# EAGLE design ADSR Waveform v1.1 (EAGLE 7.6.0)
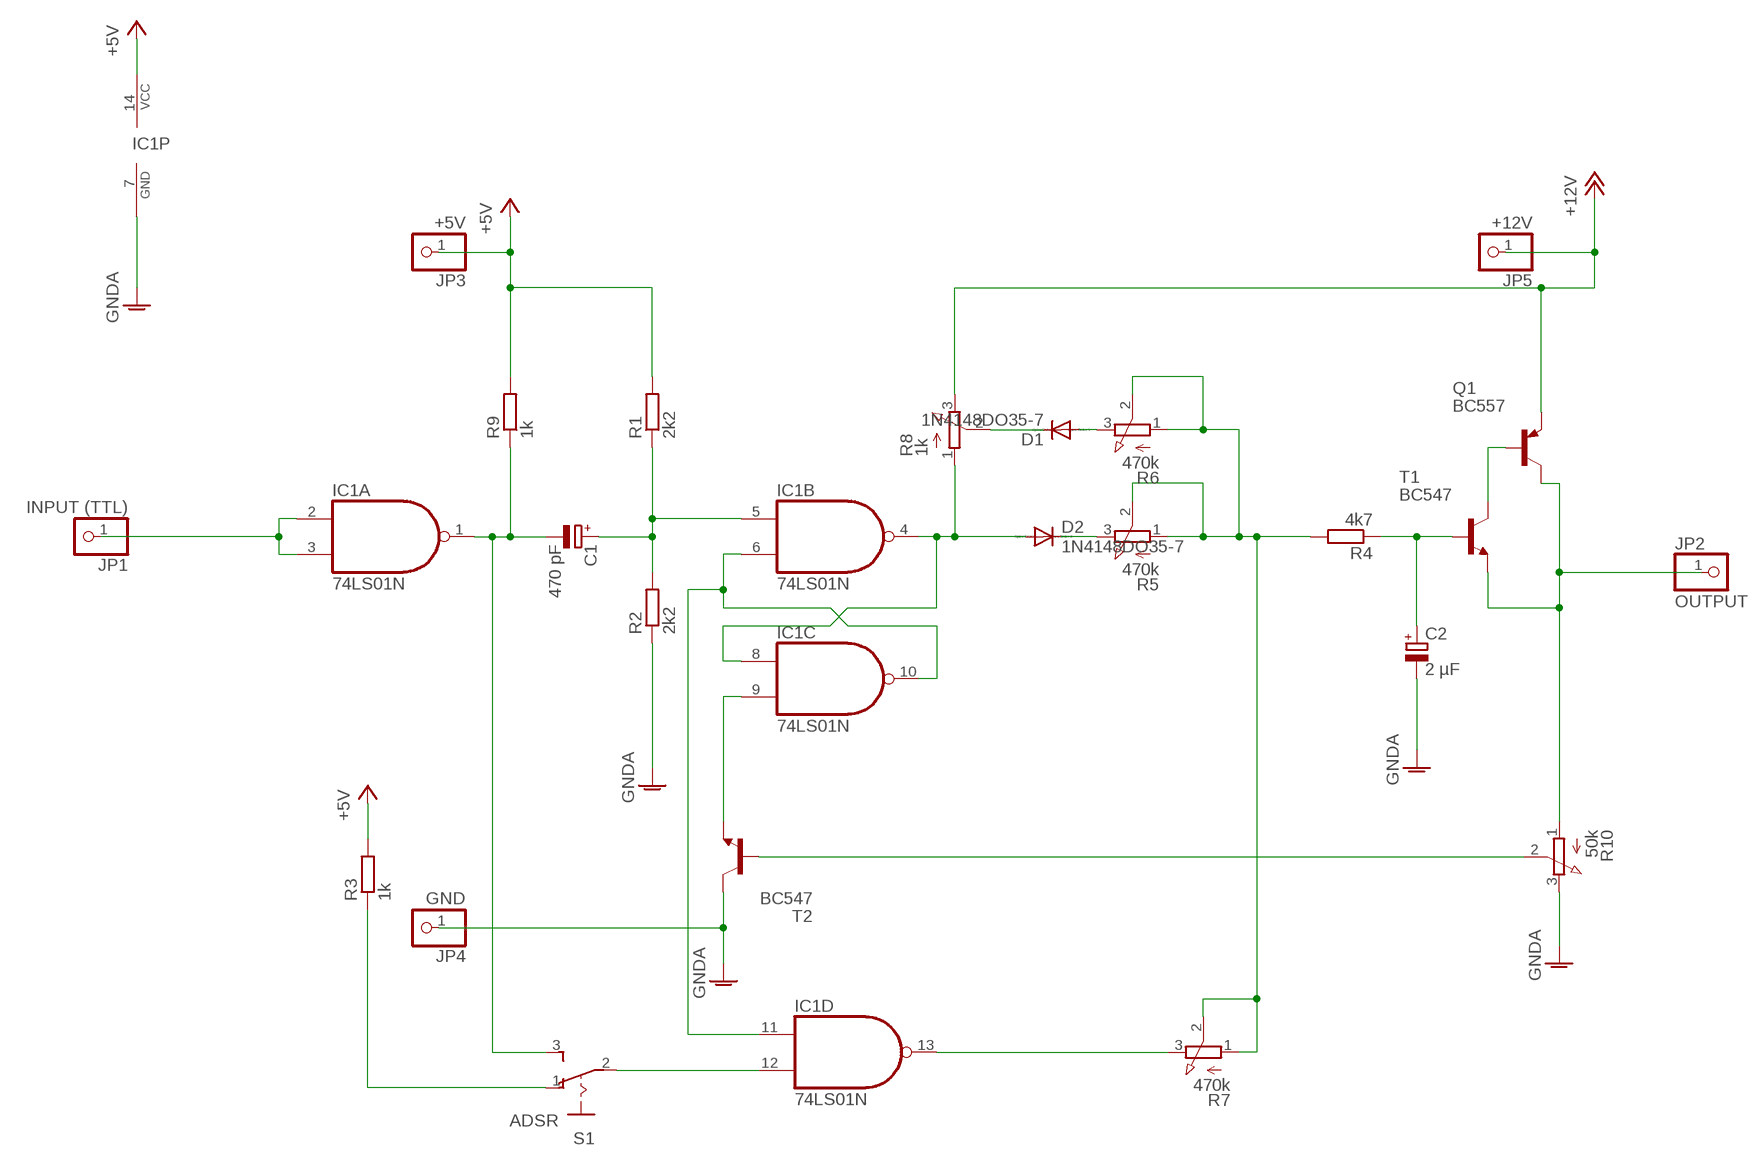
[diagram p0: schematic, sheet 1]

## Parts
C1  470 pF  CPOL-EUE5-5  [E5-5]
C2  2 µF  CPOL-EUE5-5  [E5-5]
D1  1N4148DO35-7  [DO35-7]
D2  1N4148DO35-7  [DO35-7]
IC1  74LS01N  [DIL14]
JP1  INPUT (TTL)  PINHD-1X1  [1X01]
JP2  OUTPUT  PINHD-1X1  [1X01]
JP3  +5V  PINHD-1X1  [1X01]
JP4  GND  PINHD-1X1  [1X01]
JP5  +12V  PINHD-1X1  [1X01]
Q1  BC557  [TO92]
R1  2k2  R-EU_0204/5  [0204/5]
R2  2k2  R-EU_0204/5  [0204/5]
R3  1k  R-EU_0204/5  [0204/5]
R4  4k7  R-EU_0204/5  [0204/5]
R5  470k  3RP/1610N  [3RP/1610N]
R6  470k  3RP/1610N  [3RP/1610N]
R7  470k  3RP/1610N  [3RP/1610N]
R8  1k  3RP/1610N  [3RP/1610N]
R9  1k  R-EU_0204/5  [0204/5]
R10  50k  3RP/1610N  [3RP/1610N]
S1  ADSR  255SB  [255SB]
T1  BC547  [TO92]
T2  BC547  [TO92]

## Nets
+5V: IC1.14(P:VCC) JP3.1 R1.2 R3.2 R9.2
+12V: JP5.1 Q1.1(E) R8.3(E)
GNDA: C2.- IC1.7(P:GND) JP4.1 R2.1 R10.3(E) T2.3(C)
N$1: IC1.2(A:I0) IC1.3(A:I1) JP1.1
N$2: C1.- IC1.1(A:O) R9.1 S1.3(S)
N$3: C1.+ IC1.5(B:I0) R1.1 R2.2
N$4: C2.+ R4.1 T1.2(B)
N$5: Q1.2(B) T1.3(C)
N$6: R4.2 R5.1(A) R5.2(S) R6.1(A) R6.2(S) R7.1(A) R7.2(S)
N$7: D2.C R5.3(E)
N$10: D1.A R6.3(E)
N$13: R3.1 S1.1(O)
N$14: IC1.12(D:I1) S1.2(P)
N$15: IC1.13(D:O) R7.3(E)
N$16: R10.2(S) T2.2(B)
N$17: JP2.1 Q1.3(C) R10.1(A) T1.1(E)
N$20: D2.A IC1.4(B:O) IC1.8(C:I0) R8.1(A)
N$21: IC1.6(B:I1) IC1.10(C:O) IC1.11(D:I0)
N$22: IC1.9(C:I1) T2.1(E)
N$23: D1.C R8.2(S)

## Library data of the parts
C1 C2 = resistor:CPOL-EU: POLARIZED CAPACITOR, European symbol
D1 D2 = diode:1N4148: DIODE high speed (Philips)
IC1 = 74xx-us:74*01: Quad 2-input NAND gate, open collector
JP1-JP5 = pinhead:PINHD-1X1: PIN HEADER
Q1 = transistor-pnp:BC557: PNP Transistor
R1-R4 R9 = resistor:R-EU_: RESISTOR, European symbol
R5-R8 R10 = pot:3RP/1610N: 16mm Potentiometer one level Source: http://www.alphapotentiometers.net/html/16mm_pot_2.html
S1 = switch:255SB: SLIDING SWITCH Distributor Buerklin, 11G810
T1 T2 = transistor:BC547: NPN TRANSISTOR

## Board
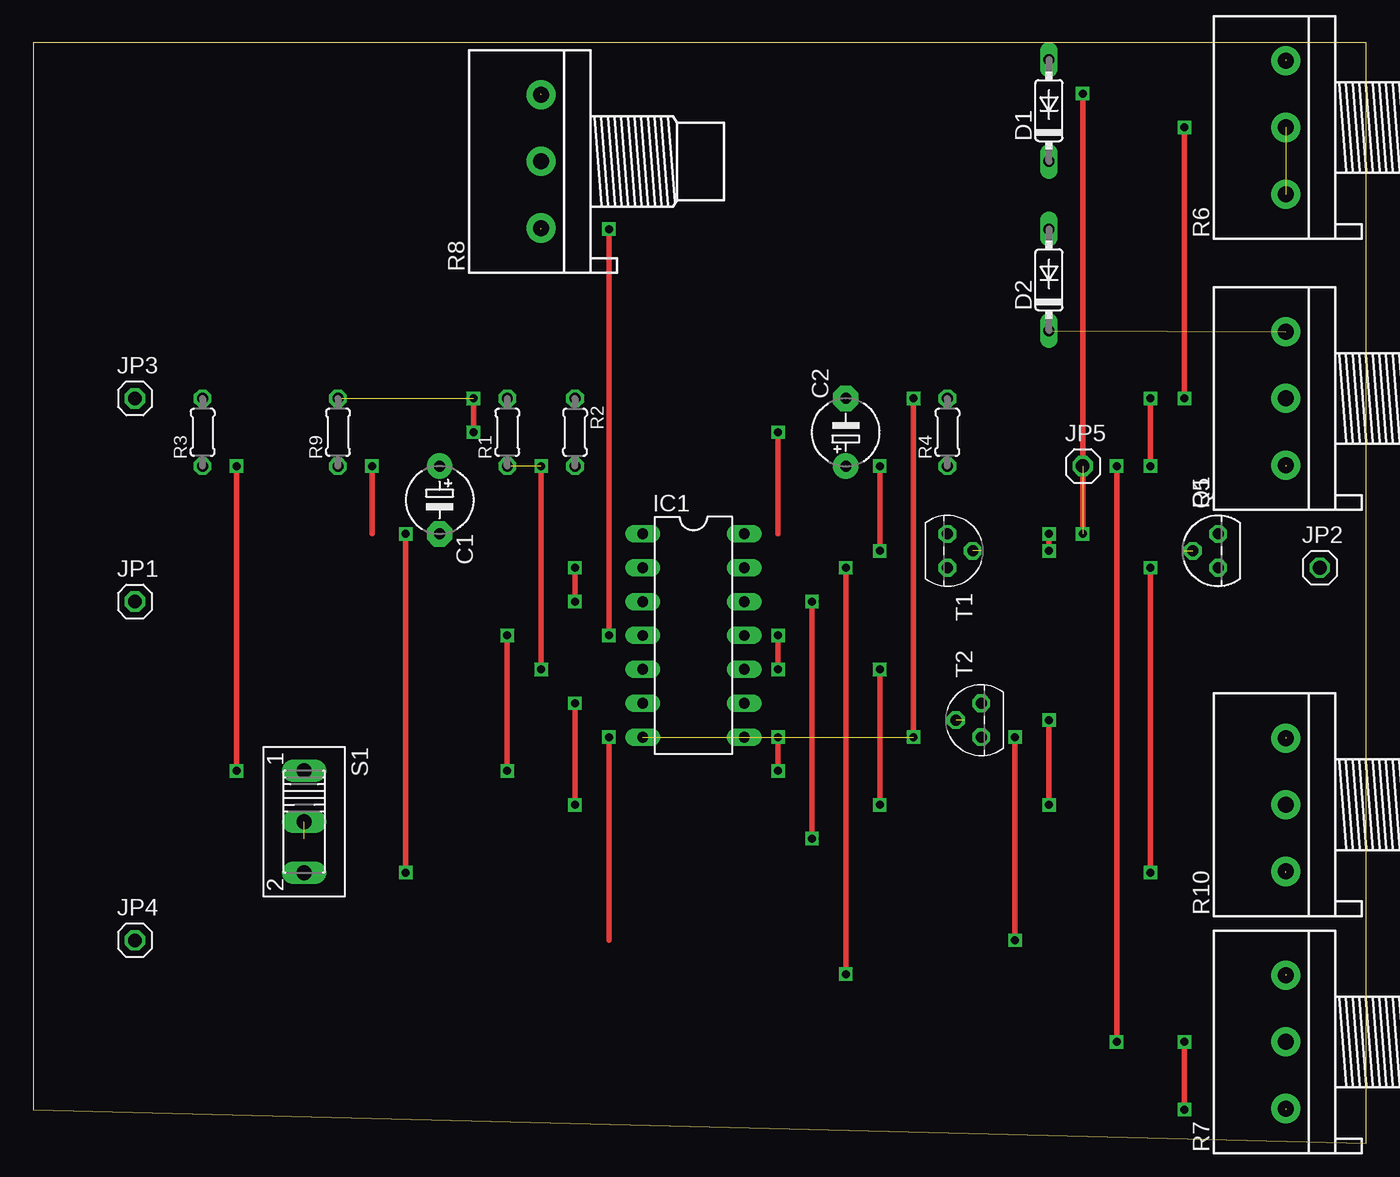
[diagram p1: board, top side]
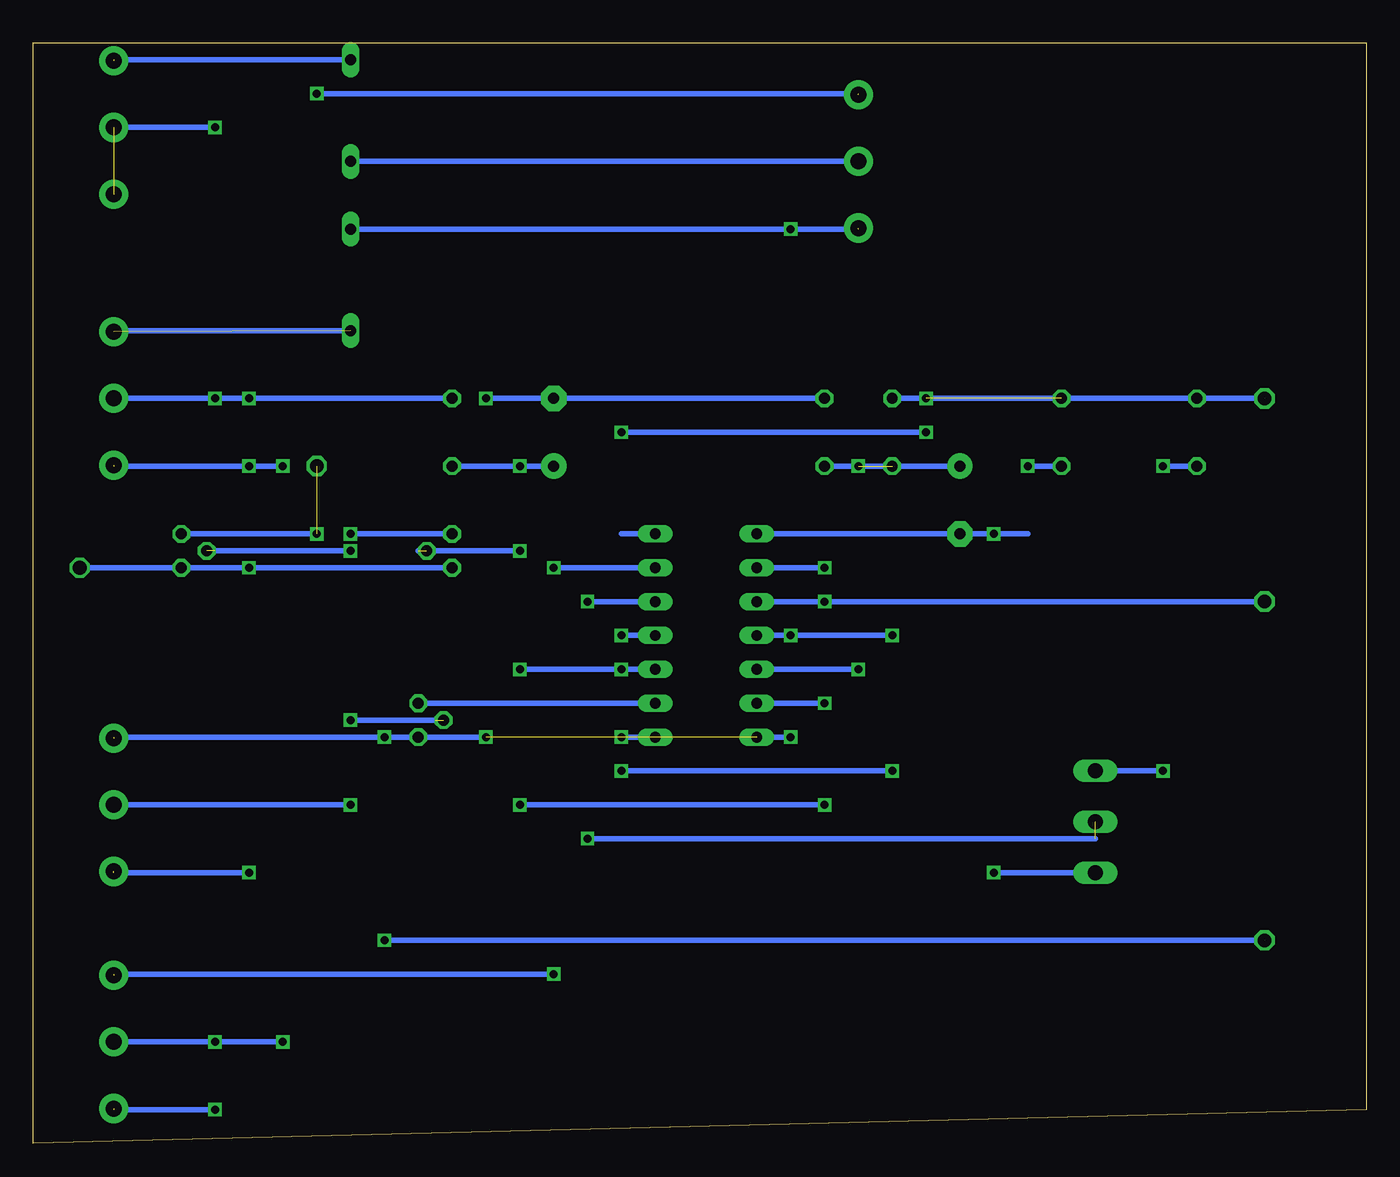
[diagram p2: board, bottom side, seen from below]

Size 100 x 82.54 mm. Coordinates in mm from the lower left corner, seen from the top.
Outline: 0,2.54 100,0 100,82.54 0,82.54 0,2.54
Copper layers (1*16): Top 0.035mm / dielectric 1.5mm / Bottom 0.035mm
Design rules "default": minimum track width 10mil, minimum drill 24mil, track to track 8mil, track to pad 8mil, pad to pad 8mil, via to via 8mil, smd to smd 8mil, copper to edge 40mil, drill to drill 8mil, minimum pad ring 10mil, minimum via ring 8mil, stop-mask expansion 4mil, vias tented up to drill 0mil, thermal gap 10mil

### Footprints (pad centres in the part's own frame; a part is rotated, then mirrored left to right if it is on the bottom)
E5-5 = drill 0.813 pad 1.905: + -2.54,0 | drill 0.813 pad 1.905 octagon: - 2.54,0
DO35-7 = drill 0.813 long: A 3.81,0; C -3.81,0
DIL14 = drill 0.813 long: 1 -7.62,-3.81; 2 -5.08,-3.81; 3 -2.54,-3.81; 4 0,-3.81; 5 2.54,-3.81; 6 5.08,-3.81; 7 7.62,-3.81; 8 7.62,3.81; 9 5.08,3.81; 10 2.54,3.81; 11 0,3.81; 12 -2.54,3.81; 13 -5.08,3.81; 14 -7.62,3.81
1X01 = drill 1.016 octagon: 1 0,0
TO92 = drill 0.813 octagon: 1 1.27,0; 2 0,1.905; 3 -1.27,0
0204/5 = drill 0.813 octagon: 1 -2.54,0; 2 2.54,0
3RP/1610N = drill 1.2 pad 2.184: 1 -5,0; 2 0,0; 3 5,0
255SB = drill 1.118 long: 1 -3.81,0; 2 0,0; 3 3.81,0

### Placement (x,y rotation side)
C1  30.48,48.26 270 top
C2  60.96,53.34 90 top
D1  76.2,77.47 90 top
D2  76.2,64.77 90 top
IC1  49.53,38.1 270 top
JP1  7.62,40.64 0 top
JP2  96.52,43.18 0 top
JP3  7.62,55.88 0 top
JP4  7.62,15.24 0 top
JP5  78.74,50.8 0 top
Q1  88.9,44.45 90 top
R1  35.56,53.34 90 top
R2  40.64,53.34 270 top
R3  12.7,53.34 90 top
R4  68.58,53.34 90 top
R5  93.98,55.88 90 top
R6  93.98,76.2 90 top
R7  93.98,7.62 90 top
R8  38.1,73.66 90 top
R9  22.86,53.34 90 top
R10  93.98,25.4 90 top
S1  20.32,24.13 270 top
T1  68.58,44.45 270 top
T2  71.12,31.75 90 top

### Tracks (layer width: path | path; a pad name or v marks a point on that pad's centre or on a via)
+5V  (via drill 0.6)  (3 unrouted)
  Top 0.406: v33.02,53.34 v33.02,55.88 | v55.88,53.34 55.88,45.72
  Bottom 0.406: R1.2 v33.02,55.88 R3.2 JP3.1 | v33.02,53.34 v55.88,53.34 | IC1.14 55.88,45.72
+12V  (via drill 0.6)  (2 unrouted)
  Top 0.406: v78.74,45.72 v78.74,78.74
  Bottom 0.406: Q1.1 v78.74,45.72 | 38.1,78.74 v78.74,78.74
GNDA  (via drill 0.6)  (3 unrouted)
  Top 0.406: v66.04,55.88 v66.04,30.48 | v73.66,30.48 v73.66,15.24 | v43.18,30.48 43.18,15.24
  Bottom 0.406: R2.1 C2.- v66.04,55.88 | 93.98,30.48 v73.66,30.48 T2.3 v66.04,30.48 | JP4.1 v73.66,15.24 | IC1.7 v43.18,30.48
N$1  (via drill 0.6)
  Top 0.406: v40.64,43.18 v40.64,40.64
  Bottom 0.406: IC1.3 v40.64,40.64 JP1.1 | IC1.2 v40.64,43.18
N$2  (via drill 0.6)  (1 unrouted)
  Top 0.406: v27.94,45.72 v27.94,20.32 | 25.4,45.72 v25.4,50.8
  Bottom 0.406: IC1.1 C1.- v27.94,45.72 25.4,45.72 | S1.3 v27.94,20.32 | R9.1 v25.4,50.8
N$3  (via drill 0.6)  (1 unrouted)
  Top 0.406: v38.1,50.8 v38.1,35.56
  Bottom 0.406: C1.+ v38.1,50.8 R2.2 | IC1.5 v38.1,35.56
N$4  (via drill 0.6)  (1 unrouted)
  Top 0.406: v63.5,50.8 v63.5,44.45
  Bottom 0.406: C2.+ v63.5,50.8 R4.1 | 71.12,44.45 v63.5,44.45
N$5  (via drill 0.6)  (1 unrouted)
  Top 0.406: v76.2,45.72 v76.2,44.45
  Bottom 0.406: T1.3 v76.2,45.72 | 86.36,44.45 v76.2,44.45
N$6  (via drill 0.6)  (3 unrouted)
  Top 0.406: v81.28,50.8 v81.28,7.62 | v86.36,2.54 v86.36,7.62 | v83.82,55.88 v83.82,50.8 | v86.36,76.2 v86.36,55.88
  Bottom 0.406: R4.2 v83.82,55.88 v86.36,55.88 R5.2 | R7.2 v86.36,7.62 v81.28,7.62 | 93.98,50.8 v83.82,50.8 v81.28,50.8 | 93.98,2.54 v86.36,2.54 | R6.2 v86.36,76.2
N$7  (1 unrouted)
N$10  (1 unrouted)
  Bottom 0.406: D1.A 93.98,81.28
N$13  (via drill 0.6)
  Top 0.406: v15.24,27.94 v15.24,50.8
  Bottom 0.406: R3.1 v15.24,50.8 | S1.1 v15.24,27.94
N$14  (via drill 0.6)  (1 unrouted)
  Top 0.406: v58.42,40.64 v58.42,22.86
  Bottom 0.406: IC1.12 v58.42,40.64 | 20.32,22.86 v58.42,22.86
N$15  (via drill 0.6)  (1 unrouted)
  Top 0.406: v60.96,43.18 v60.96,12.7
  Bottom 0.406: IC1.13 v60.96,43.18 | 93.98,12.7 v60.96,12.7
N$16  (via drill 0.6)  (1 unrouted)
  Top 0.406: v76.2,25.4 v76.2,31.75
  Bottom 0.406: R10.2 v76.2,25.4 | 69.85,31.75 v76.2,31.75
N$17  (via drill 0.6)  (1 unrouted)
  Top 0.406: v83.82,43.18 v83.82,20.32
  Bottom 0.406: JP2.1 Q1.3 v83.82,43.18 T1.1 | 93.98,20.32 v83.82,20.32
N$20  (via drill 0.6)  (1 unrouted)
  Top 0.406: v55.88,30.48 v55.88,27.94 | v35.56,38.1 v35.56,27.94 | v43.18,38.1 v43.18,68.58
  Bottom 0.406: IC1.4 v43.18,38.1 v35.56,38.1 | v55.88,30.48 IC1.8 | v35.56,27.94 v55.88,27.94 | D2.A v43.18,68.58 38.1,68.58
N$21  (via drill 0.6)
  Top 0.406: v40.64,33.02 v40.64,25.4 | v63.5,35.56 v63.5,25.4 | v55.88,38.1 v55.88,35.56
  Bottom 0.406: IC1.6 v40.64,33.02 | IC1.10 v55.88,35.56 v63.5,35.56 | v40.64,25.4 v63.5,25.4 | IC1.11 v55.88,38.1
N$22
  Bottom 0.406: T2.1 IC1.9
N$23
  Bottom 0.406: R8.2 D1.C
N$26
  Bottom 0.406: 76.2,60.96 93.98,60.96